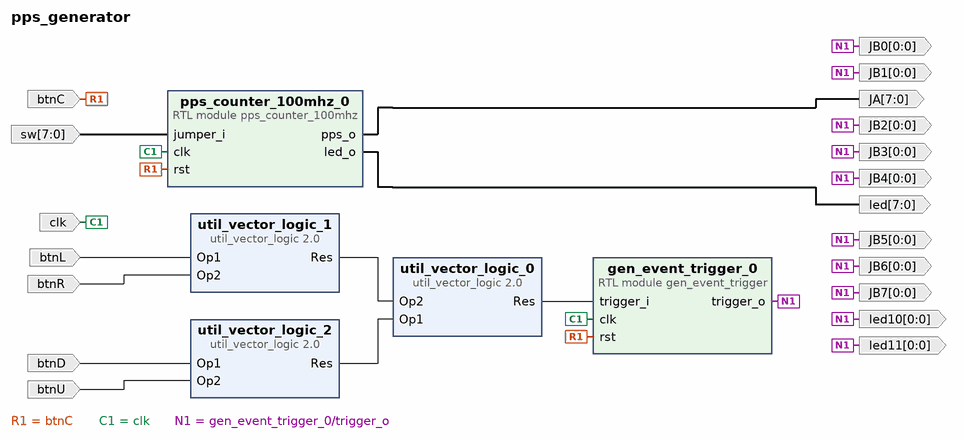
[diagram p0: block diagram of the top level]
# Vivado block design pps_generator, xc7a35tcpg236-1, Vivado 2016.4
create_bd_design pps_generator

create_bd_port -dir I -type rst btnC
set_property -dict {CONFIG.POLARITY ACTIVE_LOW} [get_bd_ports btnC]
create_bd_port -dir I -type clk clk
set_property -dict {CONFIG.ASSOCIATED_RESET btnC} [get_bd_ports clk]
create_bd_port -dir I -from 7 -to 0 sw
create_bd_port -dir O -from 7 -to 0 JA
create_bd_port -dir O -from 7 -to 0 led
create_bd_port -dir O -from 0 -to 0 JB6
create_bd_port -dir O -from 0 -to 0 JB5
create_bd_port -dir O -from 0 -to 0 JB3
create_bd_port -dir O -from 0 -to 0 JB4
create_bd_port -dir O -from 0 -to 0 JB7
create_bd_port -dir O -from 0 -to 0 led10
create_bd_port -dir O -from 0 -to 0 led11
create_bd_port -dir O -from 0 -to 0 JB0
create_bd_port -dir O -from 0 -to 0 JB2
create_bd_port -dir O -from 0 -to 0 JB1
create_bd_port -dir I btnD
create_bd_port -dir I btnU
create_bd_port -dir I btnL
create_bd_port -dir I btnR

create_bd_cell -type module -reference pps_counter_100mhz pps_counter_100mhz_0
create_bd_cell -type ip -vlnv xilinx.com:ip:util_vector_logic:2.0 util_vector_logic_0
set_property -dict {CONFIG.C_SIZE 1 CONFIG.C_OPERATION or} [get_bd_cells util_vector_logic_0]
create_bd_cell -type ip -vlnv xilinx.com:ip:util_vector_logic:2.0 util_vector_logic_1
set_property -dict {CONFIG.C_SIZE 1 CONFIG.C_OPERATION or} [get_bd_cells util_vector_logic_1]
create_bd_cell -type ip -vlnv xilinx.com:ip:util_vector_logic:2.0 util_vector_logic_2
set_property -dict {CONFIG.C_SIZE 1 CONFIG.C_OPERATION or} [get_bd_cells util_vector_logic_2]
create_bd_cell -type module -reference gen_event_trigger gen_event_trigger_0

# ---- connections ----

connect_bd_net -net reset_1 [get_bd_ports btnC] [get_bd_pins pps_counter_100mhz_0/rst] [get_bd_pins gen_event_trigger_0/rst]
connect_bd_net -net sys_clock_1 [get_bd_ports clk] [get_bd_pins pps_counter_100mhz_0/clk] [get_bd_pins gen_event_trigger_0/clk]
connect_bd_net [get_bd_ports sw] [get_bd_pins pps_counter_100mhz_0/jumper_i]
connect_bd_net [get_bd_pins pps_counter_100mhz_0/pps_o] [get_bd_ports JA]
connect_bd_net [get_bd_pins pps_counter_100mhz_0/led_o] [get_bd_ports led]
connect_bd_net -net util_vector_logic_0_Res [get_bd_pins gen_event_trigger_0/trigger_o] \
  [get_bd_ports JB1] [get_bd_ports JB2] [get_bd_ports JB0] [get_bd_ports led11] [get_bd_ports led10] [get_bd_ports JB7] \
  [get_bd_ports JB4] [get_bd_ports JB3] [get_bd_ports JB5] [get_bd_ports JB6]
connect_bd_net [get_bd_pins util_vector_logic_2/Res] [get_bd_pins util_vector_logic_0/Op1]
connect_bd_net [get_bd_pins util_vector_logic_1/Res] [get_bd_pins util_vector_logic_0/Op2]
connect_bd_net [get_bd_ports btnD] [get_bd_pins util_vector_logic_2/Op1]
connect_bd_net [get_bd_ports btnU] [get_bd_pins util_vector_logic_2/Op2]
connect_bd_net [get_bd_ports btnL] [get_bd_pins util_vector_logic_1/Op1]
connect_bd_net [get_bd_ports btnR] [get_bd_pins util_vector_logic_1/Op2]
connect_bd_net [get_bd_pins util_vector_logic_0/Res] [get_bd_pins gen_event_trigger_0/trigger_i]

validate_bd_design
save_bd_design
